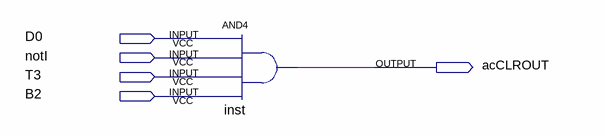
[diagram p0: schematic sheet]
// Quartus schematic acCLR.bdf as structural Verilog: 1 symbols, 5 pins
module acCLR (
  input  D0,
  input  notI,
  input  T3,
  input  B2,
  output acCLROUT
);

  and inst (acCLROUT, D0, notI, T3, B2);
endmodule
